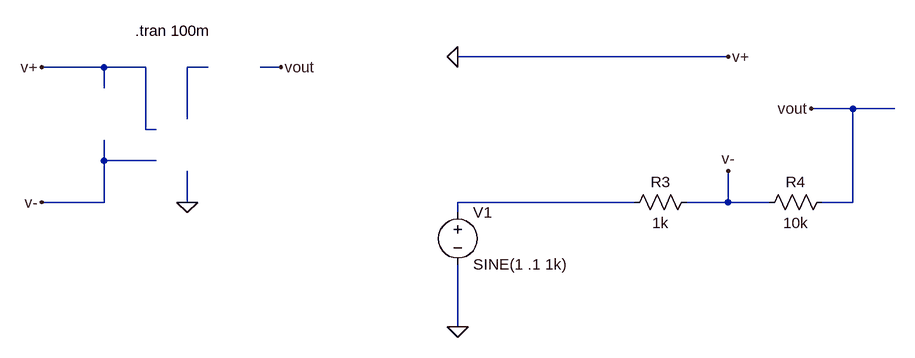
[diagram p0: schematic ex9.asc]
ex9.asc, the LTspice schematic file:
Version 4
SHEET 1 1700 680
WIRE 1440 -656 1024 -656
WIRE 480 -640 384 -640
WIRE 544 -640 480 -640
WIRE 640 -640 608 -640
WIRE 752 -640 720 -640
WIRE 480 -608 480 -640
WIRE 1632 -576 1568 -576
WIRE 1696 -576 1632 -576
WIRE 608 -560 608 -640
WIRE 544 -544 544 -640
WIRE 560 -544 544 -544
WIRE 480 -496 480 -528
WIRE 560 -496 480 -496
WIRE 480 -432 480 -496
WIRE 480 -432 384 -432
WIRE 608 -432 608 -480
WIRE 1296 -432 1024 -432
WIRE 1440 -432 1440 -480
WIRE 1440 -432 1376 -432
WIRE 1504 -432 1440 -432
WIRE 1632 -432 1632 -576
WIRE 1632 -432 1584 -432
WIRE 1024 -416 1024 -432
WIRE 1024 -240 1024 -336
FLAG 608 -432 0
FLAG 384 -640 v+
FLAG 384 -432 v-
FLAG 1440 -656 v+
FLAG 1440 -480 v-
FLAG 752 -640 vout
FLAG 1568 -576 vout
FLAG 1024 -240 0
FLAG 1024 -656 0
SYMBOL voltage 1024 -432 R0
WINDOW 123 0 0 Left 2
WINDOW 39 0 0 Left 2
SYMATTR InstName V1
SYMATTR Value SINE(1 .1 1k)
SYMBOL res 1280 -416 R270
WINDOW 0 32 56 VTop 2
WINDOW 3 0 56 VBottom 2
SYMATTR InstName R3
SYMATTR Value 1k
SYMBOL res 1488 -416 R270
WINDOW 0 32 56 VTop 2
WINDOW 3 0 56 VBottom 2
SYMATTR InstName R4
SYMATTR Value 10k
TEXT 528 -696 Left 2 !.tran 100m

The netlist it stands for:
* ex9.asc
V1 N002 0 SINE(1 .1 1k)
R3 N002 v- 1k
R4 v- vout 10k
.tran 100m
.backanno
.end